# EAGLE design esp12v21 (EAGLE 7.5.0)
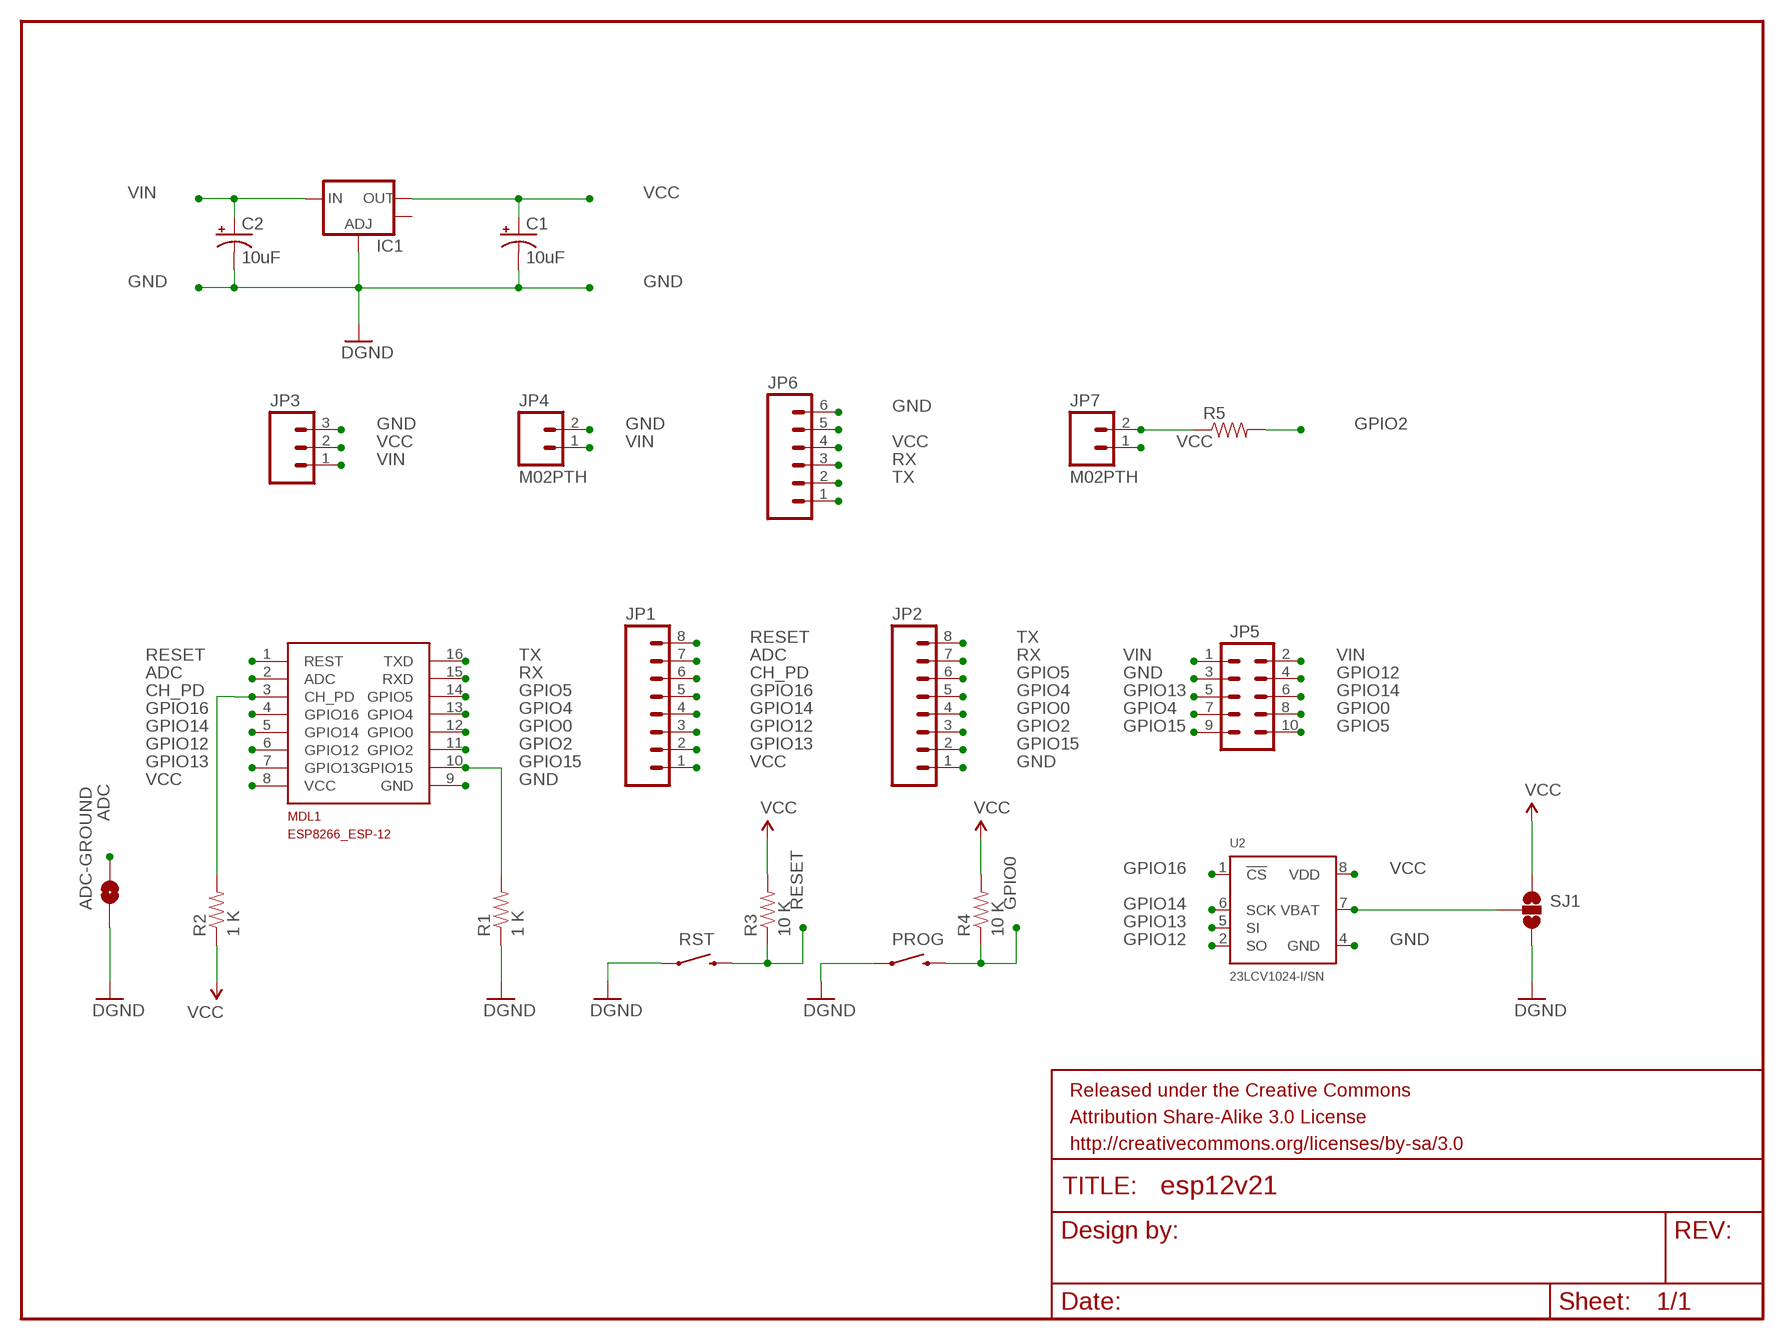
[diagram p0: schematic, sheet 1]

## Parts
ADC-GROUND  SOLDERJUMPERNO  [SJ_2S-NO]
C1  10uF  10UF-TANT  [EIA3216]
C2  10uF  10UF-TANT  [EIA3216]
FRAME1  FRAME-LETTER  [CREATIVE_COMMONS]
IC1  V_REG_LM1117SOT223  [SOT223]
JP1  M081X08  [1X08]
JP2  M081X08  [1X08]
JP3  M03PTH  [1X03]
JP4  M02PTH  [1X02]
JP5  M05X2NO_SILK  [2X5_NOSILK]
JP6  M06LOCK  [1X06_LOCK]
JP7  M02PTH  [1X02]
MDL1  ESP8266-12GPIO04/05_CORRECTED  [ESP8266-ESP12]
PROG  SWITCH-MOMENTARY-2-SMD-1101NE  [TACTILE-SWITCH-1101NE]
R1  1 K  RESISTOR0805-RES  [0805]
R2  1 K  RESISTOR0805-RES  [0805]
R3  10 K  RESISTOR0805-RES  [0805]
R4  10 K  RESISTOR0805-RES  [0805]
R5  RESISTOR0805-RES  [0805]
RST  SWITCH-MOMENTARY-2-SMD-1101NE  [TACTILE-SWITCH-1101NE]
SJ1  SOLDERJUMPER_2WAYS  [SJ_3]
U2  23LCV1024-I/SN  [SO8]

## Nets
ADC: ADC-GROUND.2 JP1.7 MDL1.2(ADC)
CH_PD: JP1.6 MDL1.3(CH_PD) R2.2
GND: ADC-GROUND.1 C1.C(-) C2.C(-) IC1.1(ADJ) JP2.1 JP3.3 JP4.2 JP5.3 JP6.6 MDL1.9(GND) PROG.P$1 R1.1 RST.P$1 SJ1.3 U2.4(GND) ; supply symbol labelled DGND
GPIO0: JP2.4 JP5.8 MDL1.12(GPIO0) PROG.P$2 R4.1
GPIO2: JP2.3 MDL1.11(GPIO2) R5.2
GPIO4: JP2.5 JP5.7 MDL1.13(GPIO4)
GPIO5: JP2.6 JP5.10 MDL1.14(GPIO5)
GPIO12: JP1.3 JP5.4 MDL1.6(GPIO12) U2.2(SO)
GPIO13: JP1.2 JP5.5 MDL1.7(GPIO13) U2.5(SI)
GPIO14: JP1.4 JP5.6 MDL1.5(GPIO14) U2.6(SCK)
GPIO15: JP2.2 JP5.9 MDL1.10(GPIO15) R1.2
GPIO16: JP1.5 MDL1.4(GPIO16) U2.1(!CS)
N$1: SJ1.2 U2.7(VBAT)
N$2: JP7.2 R5.1
N$7: JP6.5
N$11: JP6.1
RESET: JP1.8 MDL1.1(REST) R3.1 RST.P$2
RX: JP2.7 JP6.3 MDL1.15(RXD)
TX: JP2.8 JP6.2 MDL1.16(TXD)
VCC: C1.A(+) IC1.2(OUT) JP1.1 JP3.2 JP6.4 JP7.1 MDL1.8(VCC) R2.1 R3.2 R4.2 SJ1.1 U2.8(VDD)
VIN: C2.A(+) IC1.3(IN) JP3.1 JP4.1 JP5.1 JP5.2
Unconnected: IC1.4(OUT)

## Library data of the parts
ADC-GROUND = SparkFun-Passives:SOLDERJUMPER: Solder Jumper Standard SMD solder jumper. Used to automate production. Two varients : Normally Open and Normally Closed are the same, but have different paste layers. NC will have a large amount of paste and should jumper during reflow.
C1 C2 = SparkFun-Capacitors:10UF-TANT: 10uF Tantalum SMT CAP-00811- 16V 10% (EIA-3216); PROD_ID: CAP-00811
FRAME1 = SparkFun-Aesthetics:FRAME-LETTER: Schematic Frame Standard 8.5x11 US Letter frame
IC1 = SparkFun-PowerIC:V_REG_LM1117: Voltage Regulator LM1117 Standard adjustable voltage regulator but in SMD form. Spark Fun Electronics SKU : COM-00595
JP1 JP2 = SparkFun-Connectors:M08: Header 8 Standard 8-pin 0.1" header. Use with straight break away headers (SKU : PRT-00116), right angle break away headers (PRT-00553), swiss pins (PRT-00743), machine pins (PRT-00117), and female headers (PRT-00115).
JP3 = SparkFun-Connectors:M03: Header 3 Standard 3-pin 0.1" header. Use with straight break away headers (SKU : PRT-00116), right angle break away headers (PRT-00553), swiss pins (PRT-00743), machine pins (PRT-00117), and female headers (PRT-00115). Molex polarized connector foot print use with SKU : PRT-08232 with associated crimp pins and housings.
JP4 JP7 = SparkFun-Connectors:M02: Standard 2-pin 0.1" header. Use with - straight break away headers ( PRT-00116) - right angle break away headers (PRT-00553) - swiss pins (PRT-00743) - machine pins (PRT-00117) - female headers (PRT-00115) Molex polarized connector foot print use with: PRT-08233 with associated crimp pins and housings. 2.54_SCREWTERM for use with PRT-10571. 3.5mm Screw Terminal footprints for PRT-08084 5mm Screw Terminal footprints for use with PRT-08433
JP5 = SparkFun-Connectors:M05X2: Header 5x2 Standard 10-pin dual row 0.1" header. Commonly used with AVR-ISP. Use with Spark Fun Electronics SKU: PRT-00778
JP6 = SparkFun-Connectors:M06: Header 6 Standard 6-pin 0.1" header. Use with straight break away headers (SKU : PRT-00116), right angle break away headers (PRT-00553), swiss pins (PRT-00743), machine pins (PRT-00117), and female headers (PRT-00115). Molex polarized connector foot print use with SKU : PRT-08094 with associated crimp pins and housings. NOTES ON THE VARIANTS LOCK and LOCK_LONGPADS... This footprint was designed to help hold the alignment of a through-hole component (i.e. 6-pin header) while soldering it into place. You may notice that each hole has been shifted either up or down by 0.005 of an inch from it's more standard position (which is a perfectly straight line). This slight alteration caused the pins (the squares in the middle) to touch the edges of the holes. Because they are alternating, it causes a "brace" to hold the component in place. 0.005 has proven to be the perfect amount of "off-center" position when using our standard breakaway headers. Although looks a little odd when you look at the bare footprint, once you have a header in there, the alteration is very hard to notice. Also,if you push a header all the way into place, it is covered up entirely on the bottom side. This idea of altering the position of holes to aid alignment will be further integrated into the Sparkfun Library for other footprints. It can help hold any component with 3 or more connection pins.
MDL1 = ESP8266-ESP12:ESP8266-12: Espressif ESP8266 ESP-12 Module with GPIO04 and GPIO05 corrected.
PROG RST = SparkFun-Electromechanical:SWITCH-MOMENTARY-2: Various NO switches- pushbuttons, reed, etc
R1-R5 = SparkFun-Passives:RESISTOR: Resistor Basic schematic elements and footprints for 0603, 1206, and PTH resistors.
SJ1 = SparkFun-Passives:SOLDERJUMPER_2WAY: Solder Jumper 2 way solder jumper
U2 = parts23lc:23LCV1024: 1 Mbit SPI Serial SRAM with Battery Backup and SDI Interface; RS: 792-8738

## Board
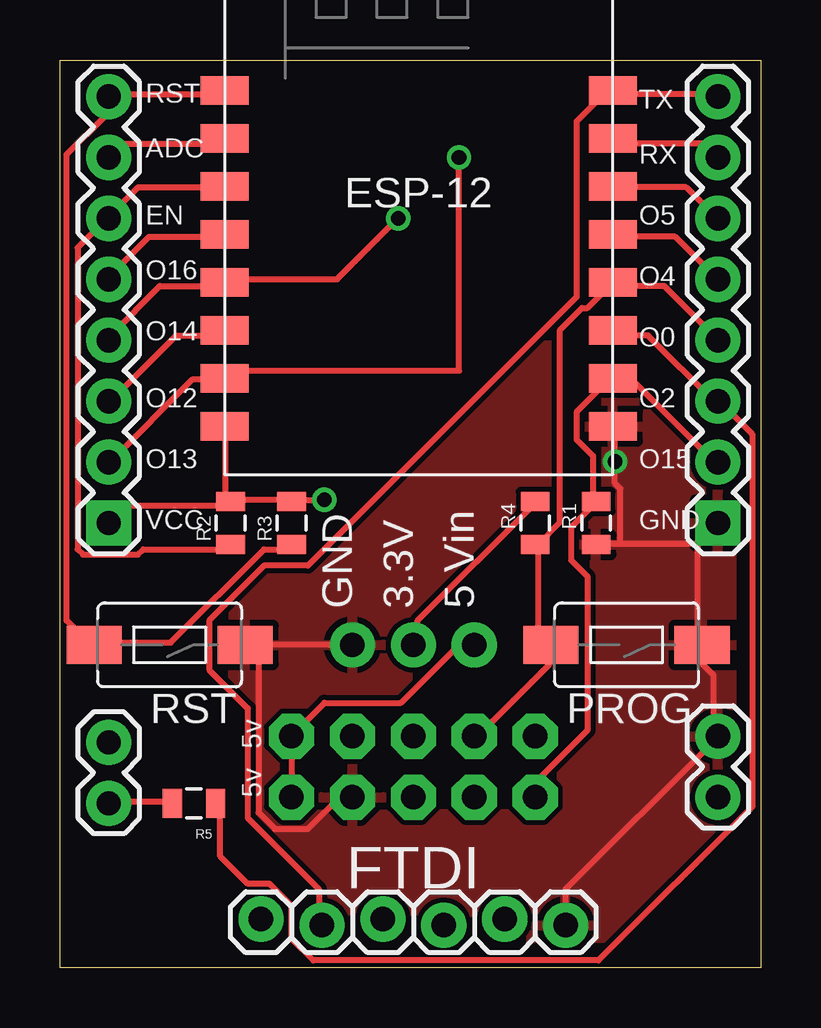
[diagram p1: board, top side]
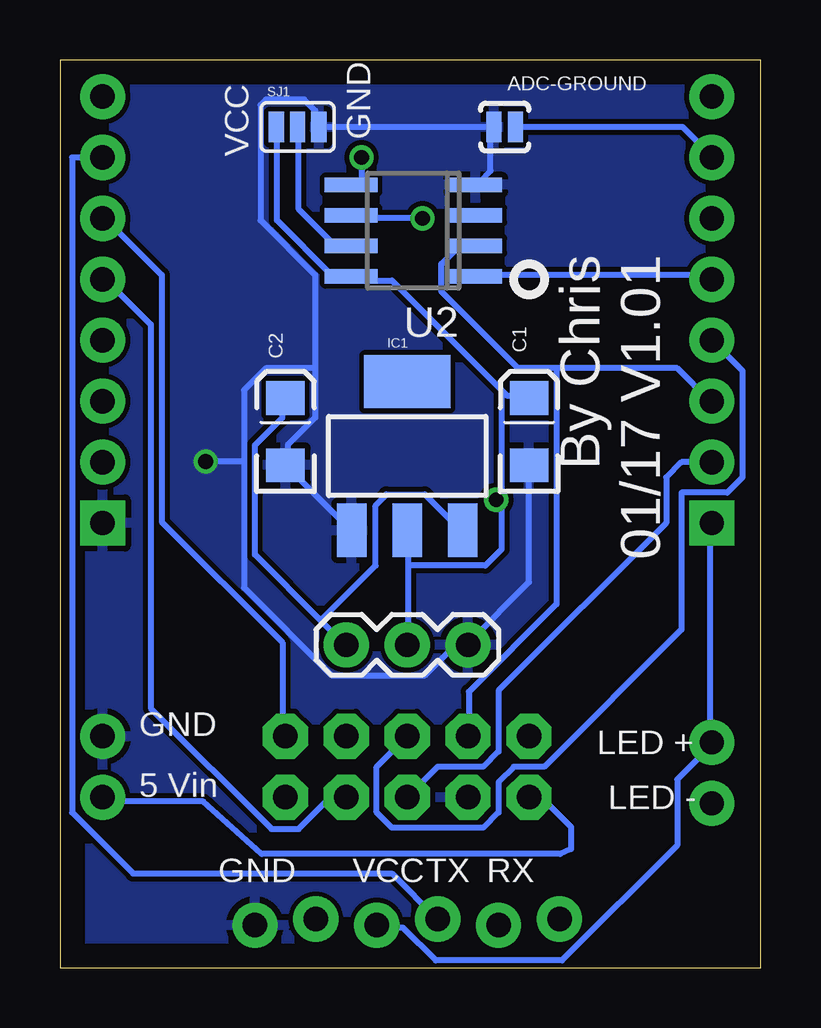
[diagram p2: board, bottom side, seen from below]

Size 29.21 x 37.85 mm. Coordinates in mm from the lower left corner, seen from the top.
Outline: 0,0 0,37.85 29.21,37.85 29.21,0 0,0
Copper layers (1*16): Top 0.035mm / dielectric 1.5mm / Bottom 0.035mm
Design rules "default": minimum track width 10mil, minimum drill 24mil, track to track 8mil, track to pad 8mil, pad to pad 8mil, via to via 8mil, smd to smd 8mil, copper to edge 40mil, drill to drill 8mil, minimum pad ring 10mil, minimum via ring 8mil, stop-mask expansion 4mil, vias tented up to drill 0mil, thermal gap 10mil

### Footprints (pad centres in the part's own frame; a part is rotated, then mirrored left to right if it is on the bottom)
SJ_2S-NO = smd 0.635 x 1.27: 1 -0.45,0; 2 0.45,0
EIA3216 = smd 1.4 x 1.6: A 1.4,0; C -1.4,0
SOT223 = smd 1.219 x 2.235: 1 -2.311,-3.099; 2 0,-3.099; 3 2.311,-3.099 | smd 3.6 x 2.2: 4 0,3.099
1X08 = drill 1.016 pad 1.88 square: 1 0,0 | drill 1.016 pad 1.88: 2 2.54,0; 3 5.08,0; 4 7.62,0; 5 10.16,0; 6 12.7,0; 7 15.24,0; 8 17.78,0
1X03 = drill 1.016 pad 1.88: 1 0,0; 2 2.54,0; 3 5.08,0
1X02 = drill 1.016 pad 1.88: 1 0,0; 2 2.54,0
2X5_NOSILK = drill 1.016 pad 1.88 octagon: 1 -1.27,5.08; 2 1.27,5.08; 3 -1.27,2.54; 4 1.27,2.54; 5 -1.27,0; 6 1.27,0; 7 -1.27,-2.54; 8 1.27,-2.54; 9 -1.27,-5.08; 10 1.27,-5.08
1X06_LOCK = drill 1.016 pad 1.88: 1 0,0; 2 2.54,-0.254; 3 5.08,0; 4 7.62,-0.254; 5 10.16,0; 6 12.7,-0.254
ESP8266-ESP12 = smd 2 x 1.2: 1 0,16; 2 0,14; 3 0,12; 4 0,10; 5 0,8; 6 0,6; 7 0,4; 8 0,2; 9 16.2,2; 10 16.2,4; 11 16.2,6; 12 16.2,8; 13 16.2,10; 14 16.2,12; 15 16.2,14; 16 16.2,16
TACTILE-SWITCH-1101NE = smd 2.3 x 1.6: P$1 -3.15,0; P$2 3.15,0
0805 = smd 0.8 x 1.2: 1 -0.9,0; 2 0.9,0
SJ_3 = smd 0.635 x 1.27: 1 -0.889,0; 2 0,0; 3 0.889,0
SO8 = smd 0.6 x 2.2: 1 -1.905,-2.6; 2 -0.635,-2.6; 3 0.635,-2.6; 4 1.905,-2.6; 5 1.905,2.6; 6 0.635,2.6; 7 -0.635,2.6; 8 -1.905,2.6

### Placement (x,y rotation side)
ADC-GROUND  10.67,35.05 0 bottom
C1  9.65,22.35 90 bottom
C2  19.81,22.35 90 bottom
FRAME1  20.32,-8.38 0 top  (outside the outline)
IC1  14.73,21.34 0 bottom
JP1  2.03,18.54 90 top
JP2  27.43,18.54 90 top
JP3  17.27,13.46 0 bottom
JP4  27.43,7.11 90 top
JP5  14.73,8.38 90 top
JP6  8.38,2.03 0 top
JP7  2.03,9.4 270 top
MDL1  6.86,20.57 0 top
PROG  23.62,13.46 180 top
R1  22.35,18.54 90 top
R2  7.11,18.54 270 top
R3  9.65,18.54 90 top
R4  19.81,18.54 90 top
R5  5.59,6.86 0 top
RST  4.57,13.46 180 top
SJ1  19.3,35.05 0 bottom
U2  14.48,30.73 90 bottom

### Tracks (layer width: path | path; a pad name or v marks a point on that pad's centre or on a via)
ADC
  Top 0.254: MDL1.2 6.68,34.37 2.56,34.37 2.11,33.91 JP1.7
  Bottom 0.254: ADC-GROUND.2 10.29,35.05 ADC-GROUND.2 | ADC-GROUND.2 10.11,35.05 3.25,35.05 2.11,33.91 JP1.7
CH_PD
  Top 0.254: R2.2 6.91,17.45 3.48,17.45 3.25,17.22 0.96,17.22 0.74,17.45 0.74,30.02 1.88,31.17 JP1.6 2.11,31.39 3.25,32.54 6.68,32.54 MDL1.3
GND  (via drill 0.61)
  Top 0.254: JP3.3 7.75,13.46 RST.P$1 8.28,13.56 8.28,6.48 8.97,5.79 10.34,5.79 11.48,6.93 12.17,6.93 JP5.3 | 26.57,17.68 23.37,17.68 | 23.37,17.68 22.45,17.68 R1.1 | 26.57,17.68 27.25,18.36 JP2.1 26.57,17.68 | 23.37,17.68 23.37,19.96 23.14,20.19 v23.14,21.11 23.14,22.48 MDL1.9 | 26.57,17.68 26.57,13.56 PROG.P$1 26.8,13.34 26.8,12.65 27.25,12.19 27.25,9.68 JP4.2 27.25,9.45 21.08,3.28 21.08,1.91 JP6.6
  Bottom 0.254: SJ1.3 18.54,35.05 SJ1.3 | C1.C 9.65,20.88 9.65,16.08 12.17,13.56 JP3.3 12.39,13.34 12.85,13.34 13.99,12.19 17.88,12.19 21.54,15.85 21.54,21.11 | IC1.1 17.2,18.36 19.71,20.88 C2.C 19.71,21.11 19.71,21.79 18.57,22.94 18.57,24.99 | 11.25,35.05 11.25,33.22 11.71,32.77 U2.4 | 11.25,35.05 ADC-GROUND.1 11.25,35.05 | 11.25,35.05 18.34,35.05 SJ1.3 | 18.57,24.99 18.57,28.88 20.85,31.17 20.85,35.97 20.62,36.2 19.03,36.2 18.57,35.74 18.57,35.05 SJ1.3 | 21.54,21.11 21.54,24.08 20.62,24.99 18.57,24.99 | 21.54,21.11 v23.14,21.11
  pour Bottom: -0.51,38.35 29.97,38.35 29.97,-0.51 -0.51,-0.51
  pour Top: -0.51,38.1 29.97,38.1 29.97,-0.51 -0.51,-0.51
GPIO0
  Top 0.254: JP2.4 27.25,26.37 25.2,28.42 23.14,28.42 MDL1.12 22.91,28.42 22,27.51 21.77,27.51 20.85,26.59 20.85,18.59 19.94,17.68 R4.1 19.94,17.45 19.94,14.02 20.4,13.56 PROG.P$2 20.4,13.34 20.4,12.65 17.42,9.68 JP5.8
GPIO2
  Top 0.254: R5.2 6.68,6.71 6.68,4.65 7.82,3.5 8.74,3.5 9.65,2.59 9.65,1.22 10.57,0.3 22.45,0.3 28.85,6.71 28.85,22.25 27.48,23.62 JP2.3 27.25,23.62 24.51,26.37 23.14,26.37 MDL1.11
GPIO4
  Top 0.254: MDL1.13 23.14,30.48 25.65,30.48 27.25,28.88 JP2.5
  Bottom 0.254: JP5.7 17.42,6.93 18.11,6.93 19.25,5.79 20.4,5.79 25.43,10.82 25.43,26.82 27.25,28.65 JP2.5
GPIO5
  Top 0.254: MDL1.14 23.14,32.54 26.11,32.54 27.25,31.39 JP2.6
  Bottom 0.254: JP5.10 19.94,9.68 19.94,13.56 24.97,18.59 24.97,28.88 27.25,31.17 JP2.6
GPIO12
  Top 0.254: MDL1.6 6.68,26.37 4.85,26.37 2.11,23.62 JP1.3
  Bottom 0.254: 8.51,24.99 3.48,24.99 2.11,23.62 JP1.3 | 8.51,24.99 10.11,24.99 13.31,28.19 13.31,29.34 12.62,30.02 11.94,30.02 U2.2 | 8.51,24.99 8.51,15.16 12.17,11.51 12.17,9.68 JP5.4
GPIO13  (via drill 0.61)
  Top 0.254: JP1.2 2.11,21.11 5.54,24.54 6.68,24.54 MDL1.7 7.11,24.89 16.64,24.89 v16.64,33.78
  Bottom 0.254: JP5.5 13.46,8.38 11.56,8.38 10.92,9.02 10.92,11.56 3.94,18.54 3.94,20.45 3.3,21.08 JP1.2 | v16.64,33.78 16.64,32.51 U2.5
GPIO14  (via drill 0.61)
  Top 0.254: JP1.4 2.11,26.37 4.17,28.42 6.68,28.42 MDL1.5 7.11,28.7 11.56,28.7 v14.1,31.24
  Bottom 0.254: JP5.6 16,8.38 16,6.48 15.37,5.84 11.56,5.84 10.92,6.48 10.92,7.75 10.29,8.38 9.02,8.38 3.3,14.1 3.3,19.81 1.4,19.81 0.76,20.45 0.76,24.89 JP1.4 | v14.1,31.24 16.64,31.24 U2.6
GPIO15
  Top 0.254: JP2.2 27.25,21.11 23.83,24.54 23.14,24.54 MDL1.10 22.91,24.54 21.54,23.16 21.54,22.02 22.23,21.34 22.23,19.51 R1.2 22.23,19.28 21.31,18.36 21.31,16.99 22,16.31 22,9.91 19.94,7.85 19.94,7.16 JP5.9
GPIO16
  Top 0.254: MDL1.4 6.68,30.48 3.71,30.48 2.11,28.88 JP1.5
  Bottom 0.254: U2.1 11.71,28.88 2.11,28.88 JP1.5
N$1
  Bottom 0.254: SJ1.2 19.25,35.05 19.25,31.62 17.88,30.25 17.2,30.25 U2.7
N$2
  Top 0.254: R5.1 4.62,6.93 2.11,6.93 JP7.2
RESET
  Top 0.254: MDL1.1 6.68,36.42 2.11,36.42 JP1.8 1.88,36.2 1.88,35.51 0.28,33.91 0.28,14.48 1.19,13.56 RST.P$2 1.42,13.56 4.62,13.56 8.51,17.45 9.65,17.45 R3.1
RX
  Top 0.254: MDL1.15 23.14,34.37 26.8,34.37 27.25,33.91 JP2.7
  Bottom 0.254: JP6.3 15.37,3.94 26.16,3.94 28.7,6.48 28.7,33.78 JP2.7
TX
  Top 0.254: JP2.8 27.25,36.42 23.14,36.42 MDL1.16 22.91,36.65 21.54,35.28 21.54,27.96 10.34,16.76 8.51,16.76 6.22,14.48 6.22,12.42 7.82,10.82 7.82,6.25 10.79,3.28 10.79,1.91 JP6.2
VCC  (via drill 0.61)
  Top 0.254: R4.2 19.71,19.28 14.91,14.48 14.91,13.56 JP3.2 | 9.65,19.51 7.14,19.51 R2.1 | 9.65,19.51 R3.2 9.65,19.51 | MDL1.8 6.91,22.48 6.91,19.51 R2.1 | R2.1 6.91,19.28 2.79,19.28 2.11,18.59 JP1.1 | 9.65,19.51 v11.02,19.51
  Bottom 0.254: 14.68,16.76 14.68,13.56 JP3.2 | 14.68,16.76 14.68,18.14 IC1.2 | SJ1.1 20.17,35.05 20.17,31.17 17.88,28.88 17.2,28.88 U2.8 16.97,28.65 15.37,28.65 10.79,24.08 | 10.79,24.08 10.57,23.85 9.65,23.85 C1.A | 14.68,16.76 11.48,16.76 10.79,17.45 10.79,19.51 | 10.79,24.08 10.79,19.51 | JP1.1 2.11,18.36 2.11,9.45 JP7.1 2.11,9.22 3.48,7.85 3.48,5.11 8.28,0.3 13.54,0.3 14.91,1.68 15.82,1.68 JP6.4 | v11.02,19.51 10.79,19.51
VIN
  Top 0.254: JP5.1 9.65,7.16 9.65,9.45 JP5.2 9.65,9.68 11.02,11.05 14.22,11.05 16.51,13.34 17.2,13.34 JP3.1
  Bottom 0.254: 18.34,14.48 17.42,13.56 JP3.1 | 18.34,14.48 21.08,17.22 21.08,21.79 19.94,22.94 19.94,23.62 C2.A | 18.34,14.48 16.05,16.76 16.05,19.28 15.6,19.74 13.99,19.74 12.62,18.36 IC1.3 | JP4.1 27.25,6.93 23.24,6.93 20.8,4.75 8.36,4.75 7.9,4.95 7.9,5.87 8.97,6.93 9.65,6.93 JP5.1

### Text on the board
tNames: RST | TX | ADC | RX | EN | O5 | O16 | O4 | O14 | O0 | O12 | O2 | O13 | O15 | VCC | GND | GND | 3.3V | 5 Vin | 5v | 5v | FTDI
bNames: VCC | GND | By Chris / 01/17 V1.01 | LED + | GND | LED - | 5 Vin | RX | TX | VCC | GND